# Altium schematic sheet AC_Dimmer.SchDoc
size A; SheetNumber: 1; SheetTotal: 1
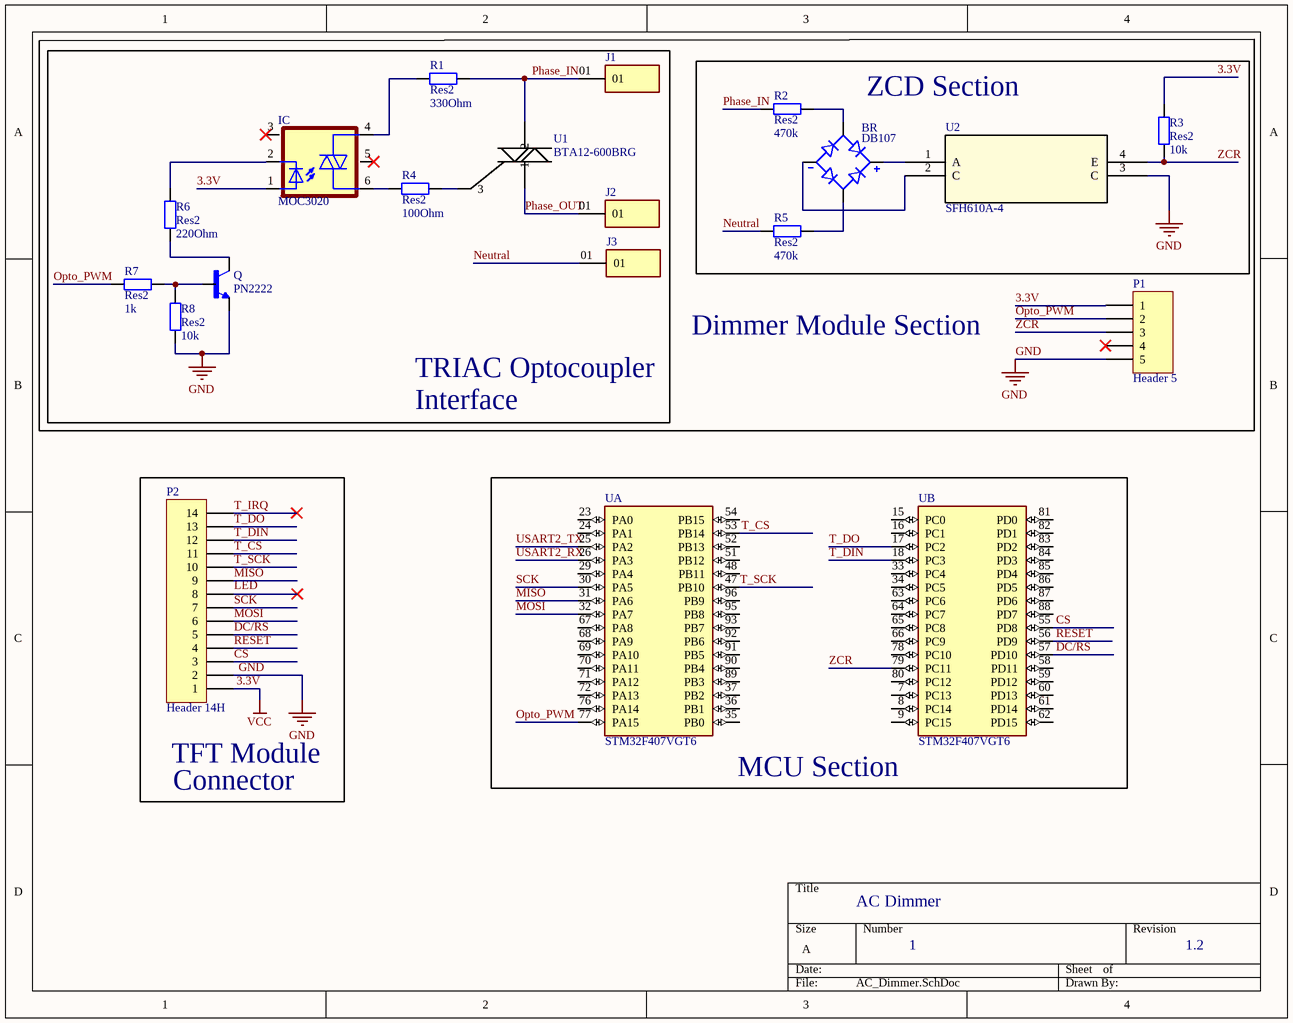
[diagram p0: AC_Dimmer.SchDoc]

## Parts
BR  DB107  [DIP825W50P509L880H320Q4]
IC  MOC3020  [DIL06-A]
J1  MTMM-101-07-T-S-230  [SAMTEC_MTMM-101-07-T-S-230]  (value not drawn)
J2  MTMM-101-07-T-S-230  [SAMTEC_MTMM-101-07-T-S-230]  (value not drawn)
J3  MTMM-101-07-T-S-230  [SAMTEC_MTMM-101-07-T-S-230]  (value not drawn)
P1  Header 5  [HDR1X5]
P2  Header 14H  [HDR1X14H]
Q  PN2222  [TO92]
R1  Res2  value 330Ohm  [AXIAL-0.4]
R2  Res2  value 470k  [AXIAL-0.4]
R3  Res2  value 10k  [AXIAL-0.4]
R4  Res2  value 100Ohm  [AXIAL-0.4]
R5  Res2  value 470k  [AXIAL-0.4]
R6  Res2  value 220Ohm  [AXIAL-0.4]
R7  Res2  value 1k  [AXIAL-0.4]
R8  Res2  value 10k  [AXIAL-0.4]
U  STM32F407VGT6  [QFP50P1600X1600X160-100N]  (parts A,B of 3)
U1  BTA12-600BRG  [TO-220AB_STM]
U2  SFH610A-4  [DIP-4_SFH610A_VIS]

## Blocks framed on the sheet
MCU Section: U

## Nets
3.3V: IC.1(A) P1.1 P2.1 R3.1  [also labelled VCC]
GND: P1.5 P2.2 Q.1(E) R8.2 U2.3(C)
CS: P2.3 U.55(PD8)
DC/RS: P2.5 U.57(PD10)
MISO: P2.9 U.31(PA6)
MOSI: P2.6 U.32(PA7)
Neutral: J3.01 R5.1
Opto_PWM: P1.2 R7.2 U.77(PA15)
Phase_IN: J1.01 R1.1 R2.1 U1.2
Phase_OUT: J2.01 U1.1
RESET: P2.4 U.56(PD9)
SCK: P2.7 U.30(PA5)
T_CS: P2.11 U.53(PB14)
T_DIN: P2.12 U.18(PC3)
T_DO: P2.13 U.17(PC2)
T_IRQ: P2.14
T_SCK: P2.10 U.47(PB10)
USART2_RX: U.26(PA3)
USART2_TX: U.25(PA2)
ZCR: P1.3 R3.2 U.79(PC11) U2.4(E)
NetBR_1: BR.1(POS) U2.1(A)
NetBR_2: BR.2(NEG) U2.2(C)
NetBR_3: BR.3(AC1) R5.2
NetBR_4: BR.4(AC2) R2.2
NetIC_2: IC.2(C) R6.1
NetIC_4: IC.4(A1) R1.2
NetIC_6: IC.6(A2) R4.2
NetQ_2: Q.2(B) R7.1 R8.1
NetQ_3: Q.3(C) R6.2
NetR4_1: R4.1 U1.3

Not connected (* = marked no-connect by the designer): IC 3(P$1)* 5(P$2)*; P1 4*; P2 8*; U 7(PC13) 8(PC14) 9(PC15) 15(PC0) 16(PC1) 23(PA0) 24(PA1) 29(PA4) 33(PC4) 34(PC5) 35(PB0) 36(PB1) 37(PB2) 48(PB11) 51(PB12) 52(PB13) 54(PB15) 58(PD11) 59(PD12) 60(PD13) 61(PD14) 62(PD15) 63(PC6) 64(PC7) 65(PC8) 66(PC9) 67(PA8) 68(PA9) 69(PA10) 70(PA11) 71(PA12) 72(PA13) 76(PA14) 78(PC10) 80(PC12) 81(PD0) 82(PD1) 83(PD2) 84(PD3) 85(PD4) 86(PD5) 87(PD6) 88(PD7) 89(PB3) 90(PB4) 91(PB5) 92(PB6) 93(PB7) 95(PB8) 96(PB9)

## Notes on the sheet
- (near BR) ZCD Section
- Dimmer Module Section
- TRIAC Optocoupler
- Interface
- (near P2) TFT Module
- Connector
- AC Dimmer
- 1
- 1.2
- Labels drawn without touching a wire or pin: LED

## Library data of the parts
BR = DB107: Bridge Rectifier Single Phase Standard 1kV Surface Mount DB-S; MF: EIC Semiconductor; Value: *; Mouser-Purchase-URL: https://snapeda.com/shop?store=Mouser&id=4479936; MP: DB107; Price: None; Availability: Warning; Package: EDIP-4 EIC Semiconductor; SnapEDA_Link: https://www.snapeda.com/parts/DB107/EIC%20Semiconductor/view-part/4479936/?ref=snap; Check_prices: https://www.snapeda.com/parts/DB107/EIC%20Semiconductor/view-part/4479936/?ref=eda
IC = MOC3020: Optoisolator Triac Output 5300Vrms 1 Channel 6-DIP; MF: ON Semiconductor; SnapEDA_Link: https://www.snapeda.com/parts/MOC3020/ON%20Semiconductor/view-part/2780094/?ref=snap; MP: MOC3020; Availability: Unavailable; Price: None; Value: *; Package: DIP-6 ON Semiconductor
P1 = Header 5: Header, 5-Pin; LatestRevisionDate: 17-Jul-2002; LatestRevisionNote: Re-released for DXP Platform.; Publisher: Altium Limited
P2 = Header 14H: Header, 14-Pin, Right Angle; LatestRevisionDate: 17-Jul-2002; LatestRevisionNote: Re-released for DXP Platform.; Publisher: Altium Limited
Q = PN2222: Bipolar (BJT) Transistor NPN 40V 1A 300MHz 625mW Through Hole TO-92-3; MF: ON Semiconductor; SnapEDA_Link: https://www.snapeda.com/parts/PN2222/ON%20Semiconductor/view-part/587161/?ref=snap; Price: None; Availability: Unavailable; Package: TO-226-3 National Semiconductor; Value: *; MP: PN2222
R1-R8 = Res2: Resistor; Published: 8-Jun-2000; LatestRevisionDate: 17-Jul-2002; LatestRevisionNote: Re-released for DXP Platform.; PackageReference: AXIAL-0.4; Publisher: Altium Limited; PackageDescription: Axial Device, Thru-Hole; 2 Leads; 0.4 in Pin Spacing
U = STM32F407VGT6: ARMÂ® CortexÂ®-M4 STM32F4 Microcontroller IC 32-Bit 168MHz 1MB _1M x 8_ FLASH 100-LQFP _14x14_; MF: STMicroelectronics; Value: *; SnapEDA_Link: https://www.snapeda.com/parts/STM32F407VGT6/STMicroelectronics/view-part/106801/?ref=snap; MP: STM32F407VGT6; Availability: Unavailable; Price: None; Package: LQFP-100 STMicroelectronics
U1 = BTA12-600BRG: No Description Available; Mfr_Name: STMicroelectronics; Copyright: Copyright (C) 2022 Ultra Librarian. All rights reserved.; Manufacturer_Part_Number: BTA12-600BRG; RefDes: RefDes; Type: DEV
U2 = SFH610A-4: No Description Available; Mfr_Name: Vishay; Copyright: Copyright (C) 2022 Ultra Librarian. All rights reserved.; Manufacturer_Part_Number: SFH610A-4; RefDes: RefDes; Type: DEV
J1-J3 = MTMM-101-07-T-S-230: Package: None; Price: None; Value: *; MP: MTMM-101-07-T-S-230; Availability: Unavailable